# EAGLE design Cassette Port (EAGLE 9.5.2)
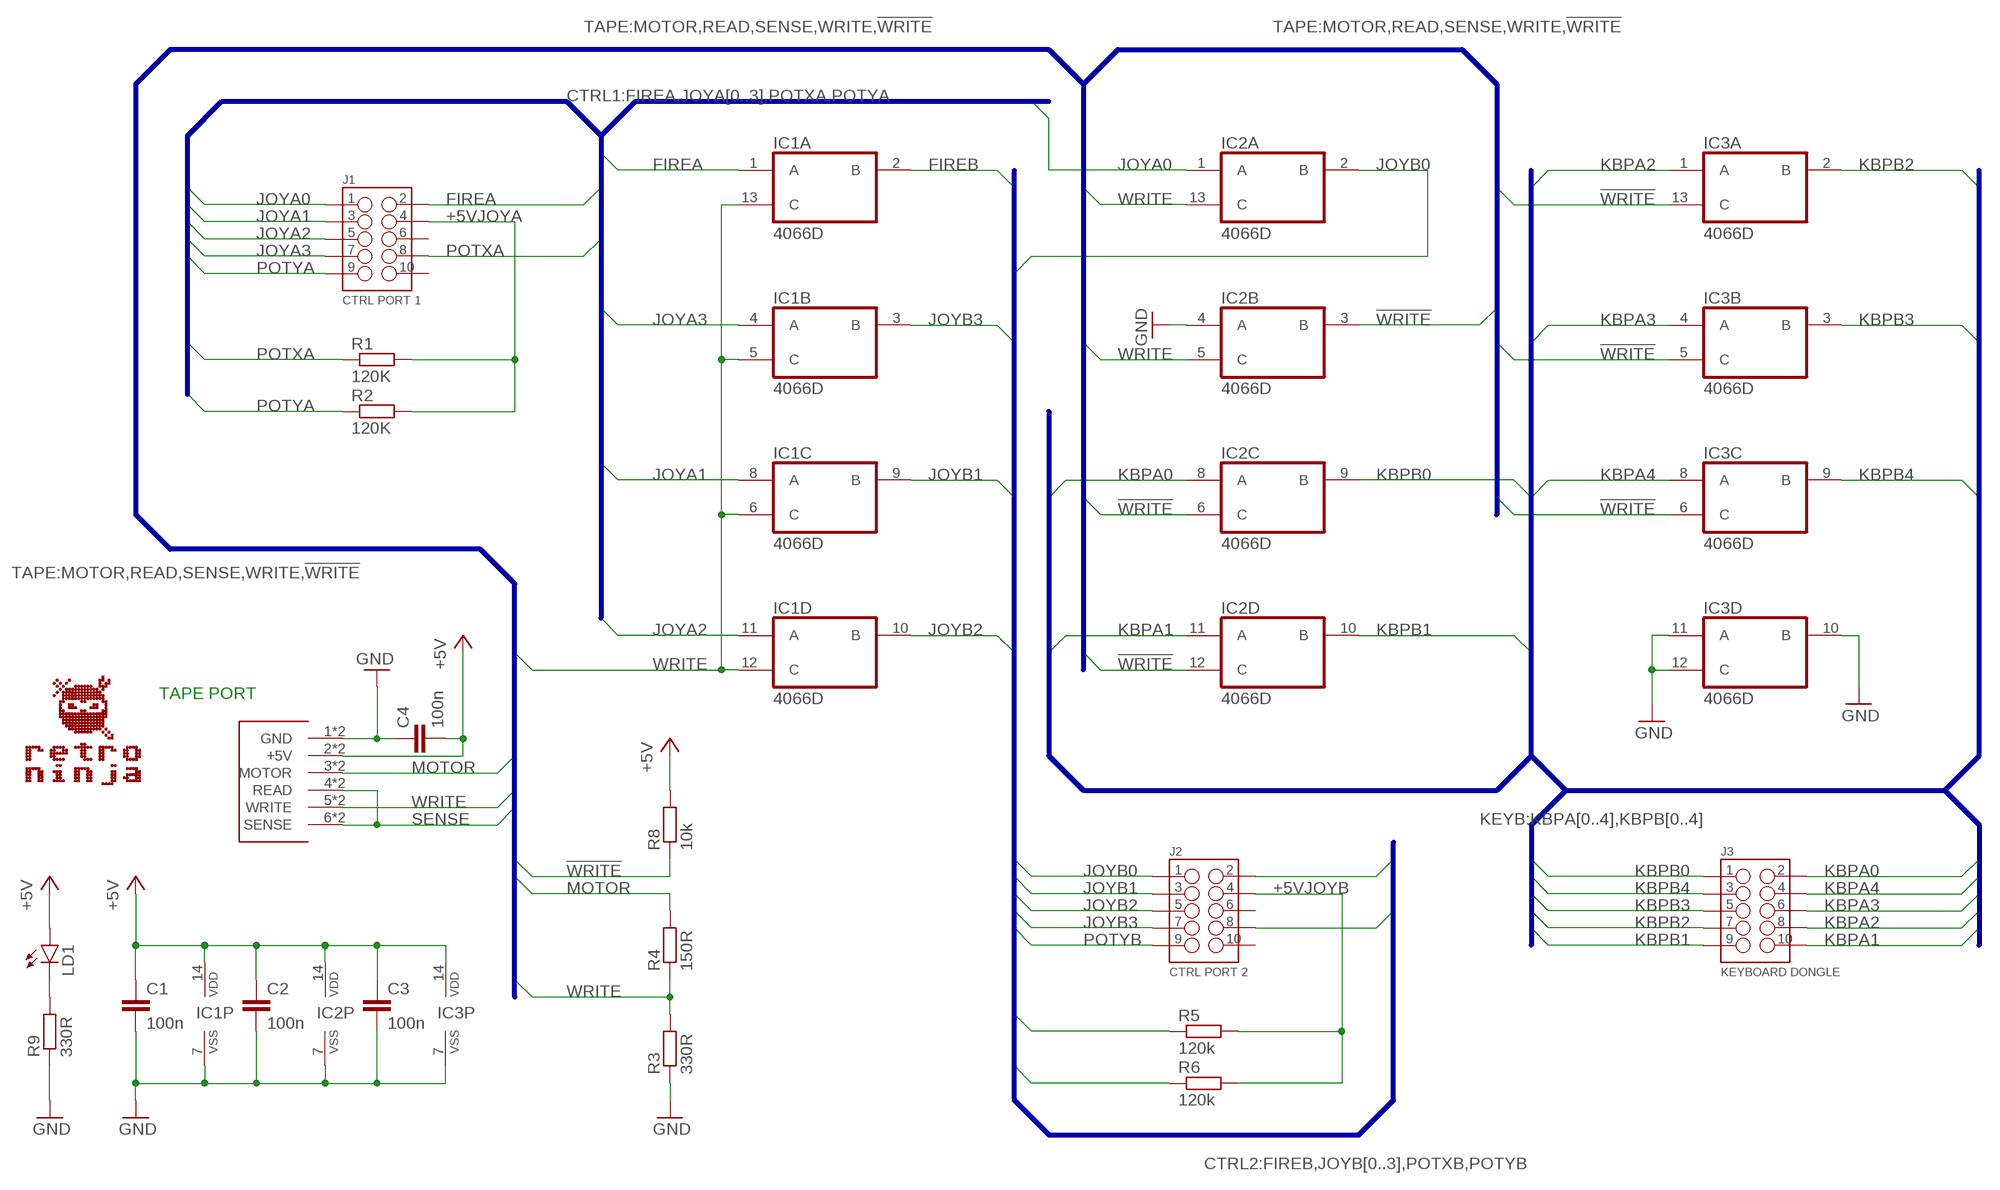
[diagram p0: schematic, sheet 1]

## Parts
C1  100n  C-EUC0805  [C0805]
C2  100n  C-EUC0805  [C0805]
C3  100n  C-EUC0805  [C0805]
C4  100n  C-EUC0805  [C0805]
CN1  C64_CASSETTE_PORT_CONNECTOR_SIDE  [C64_CASSETTE_CONNECTOR]
IC1  4066D  [SO14]
IC2  4066D  [SO14]
IC3  4066D  [SO14]
J1  CTRL PORT 1  HEADER_2X5-WALLED  [2X5_HEADER_WALLED]
J2  CTRL PORT 2  HEADER_2X5-WALLED  [2X5_HEADER_WALLED]
J3  KEYBOARD DONGLE  HEADER_2X5-WALLED  [2X5_HEADER_WALLED]
LD1  LED3MM  [LED3MM]
R1  120K  R-EU_R0805  [R0805]
R2  120K  R-EU_R0805  [R0805]
R3  330R  R-EU_R0805  [R0805]
R4  150R  R-EU_R0805  [R0805]
R5  120k  R-EU_R0805  [R0805]
R6  120k  R-EU_R0805  [R0805]
R8  10k  R-EU_R0805  [R0805]
R9  330R  R-EU_R0805  [R0805]
U$1  RETRONINJA_TEXT  [RETRONINJA_TEXT_17MM]

## Nets
!WRITE: IC2.3(B:B) IC2.6(C:C) IC2.12(D:C) IC3.5(B:C) IC3.6(C:C) IC3.13(A:C) R8.1
+5V: C1.1 C2.1 C3.1 C4.2 CN1.2(+5V) CN1.B(+5V) IC1.14(P:VDD) IC2.14(P:VDD) IC3.14(P:VDD) LD1.A R8.2
+5VJOYA: J1.4 R1.2 R2.2
+5VJOYB: J2.4 R5.2 R6.2
FIREA: IC1.1(A:A) J1.2
FIREB: IC1.2(A:B) J2.2
GND: C1.2 C2.2 C3.2 C4.1 CN1.1(GND) CN1.A(GND) IC1.7(P:VSS) IC2.4(B:A) IC2.7(P:VSS) IC3.7(P:VSS) IC3.10(D:B) IC3.11(D:A) IC3.12(D:C) R3.1 R9.1
JOYA0: IC2.1(A:A) J1.1
JOYA1: IC1.8(C:A) J1.3
JOYA2: IC1.11(D:A) J1.5
JOYA3: IC1.4(B:A) J1.7
JOYB0: IC2.2(A:B) J2.1
JOYB1: IC1.9(C:B) J2.3
JOYB2: IC1.10(D:B) J2.5
JOYB3: IC1.3(B:B) J2.7
KBPA0: IC2.8(C:A) J3.2
KBPA1: IC2.11(D:A) J3.10
KBPA2: IC3.1(A:A) J3.8
KBPA3: IC3.4(B:A) J3.6
KBPA4: IC3.8(C:A) J3.4
KBPB0: IC2.9(C:B) J3.1
KBPB1: IC2.10(D:B) J3.9
KBPB2: IC3.2(A:B) J3.7
KBPB3: IC3.3(B:B) J3.5
KBPB4: IC3.9(C:B) J3.3
MOTOR: CN1.3(MOTOR) CN1.C(MOTOR) R4.2
N$2: LD1.K(C) R9.2
POTXA: J1.8 R1.1
POTXB: J2.8 R5.1
POTYA: J1.9 R2.1
POTYB: J2.9 R6.1
SENSE: CN1.4(READ) CN1.6(SENSE) CN1.D(READ) CN1.F(SENSE)
WRITE: CN1.5(WRITE) CN1.E(WRITE) IC1.5(B:C) IC1.6(C:C) IC1.12(D:C) IC1.13(A:C) IC2.5(B:C) IC2.13(A:C) R3.2 R4.1
Unconnected: J1.6 J1.10 J2.6 J2.10

## Buses
CTRL1:FIREA,JOYA[0..3],POTXA,POTYA
CTRL2:FIREB,JOYB[0..3],POTXB,POTYB
TAPE:MOTOR,READ,SENSE,WRITE,!WRITE
KEYB:KBPA[0..4],KBPB[0..4]

## Notes on the sheet
- TAPE PORT

## Library data of the parts
C1-C4 = rcl:C-EU: CAPACITOR, European symbol; SPICEPREFIX: C
CN1 = Per:C64_CASSETTE_PORT
IC1-IC3 = 40xx:4066: Quad bilateral ANALOG SWITCH
J1-J3 = Per:HEADER_2X5
LD1 = led:LED: LED OSRAM: - CHIPLED LG R971, LG N971, LY N971, LG Q971, LY Q971, LO R971, LY R971 LH N974, LH R974 LS Q976, LO Q976, LY Q976 LO Q996 - Hyper CHIPLED LW Q18S LB Q993, LB Q99A, LB R99A - SideLED LS A670, LO A670, LY A670, LG A670, LP A670 LB A673, LV A673, LT A673, LW A673 LH A674 LY A675 LS A676, LA A676, LO A676, LY A676, LW A676 LS A679, LY A679, LG A679 - Hyper Micro SIDELED® LS Y876, LA Y876, LO Y876, LY Y876 LT Y87S - SmartLED LW L88C, LW L88S LB L89C, LB L89S, LG L890 LS L89K, LO L89K, LY L89K LS L896, LA L896, LO L896, LY L896 - TOPLED LS T670, LO T670, LY T670, LG T670, LP T670 LSG T670, LSP T670, LSY T670, LOP T670, LYG T670 LG T671, LOG T671, LSG T671 LB T673, LV T673, LT T673, LW T673 LH T674 LS T676, LA T676, LO T676, LY T676, LB T676, LH T676, LSB T676, LW T676 LB T67C, LV T67C, LT T67C, LS T67K, LO T67K, LY T67K, LW E67C LS E67B, LA E67B, LO E67B, LY E67B, LB E67C, LV E67C, LT E67C LW T67C LS T679, LY T679, LG T679 LS T770, LO T770, LY T770, LG T770, LP T770 LB T773, LV T773, LT T773, LW T773 LH T774 LS E675, LA E675, LY E675, LS T675 LS T776, LA T776, LO T776, LY T776, LB T776 LHGB T686 LT T68C, LB T68C - Hyper Mini TOPLED® LB M676 - Mini TOPLED Santana® LG M470 LS M47K, LO M47K, LY M47K Source: http://www.osram.convergy.de LUXEON: - LUMILED® LXK2-PW12-R00, LXK2-PW12-S00, LXK2-PW14-U00, LXK2-PW14-V00 LXK2-PM12-R00, LXK2-PM12-S00, LXK2-PM14-U00 LXK2-PE12-Q00, LXK2-PE12-R00, LXK2-PE12-S00, LXK2-PE14-T00, LXK2-PE14-U00 LXK2-PB12-K00, LXK2-PB12-L00, LXK2-PB12-M00, LXK2-PB14-N00, LXK2-PB14-P00, LXK2-PB14-Q00 LXK2-PR12-L00, LXK2-PR12-M00, LXK2-PR14-Q00, LXK2-PR14-R00 LXK2-PD12-Q00, LXK2-PD12-R00, LXK2-PD12-S00 LXK2-PH12-R00, LXK2-PH12-S00 LXK2-PL12-P00, LXK2-PL12-Q00, LXK2-PL12-R00 Source: www.luxeon.com KINGBRIGHT: KA-3528ASYC Source: www.kingbright.com
R1-R6 R8 R9 = rcl:R-EU_: RESISTOR, European symbol; SPICEPREFIX: R
U$1 = PCBGraphics:RETRONINJA_TEXT

## Board
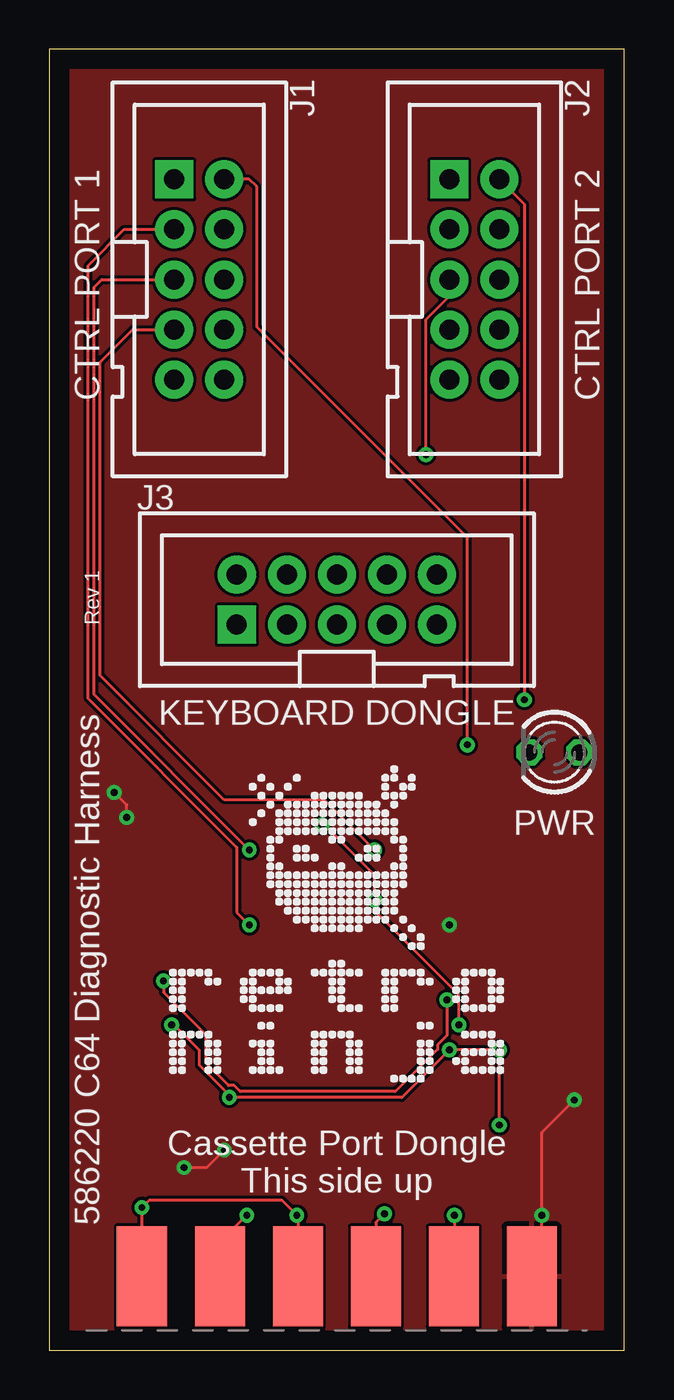
[diagram p1: board, top side]
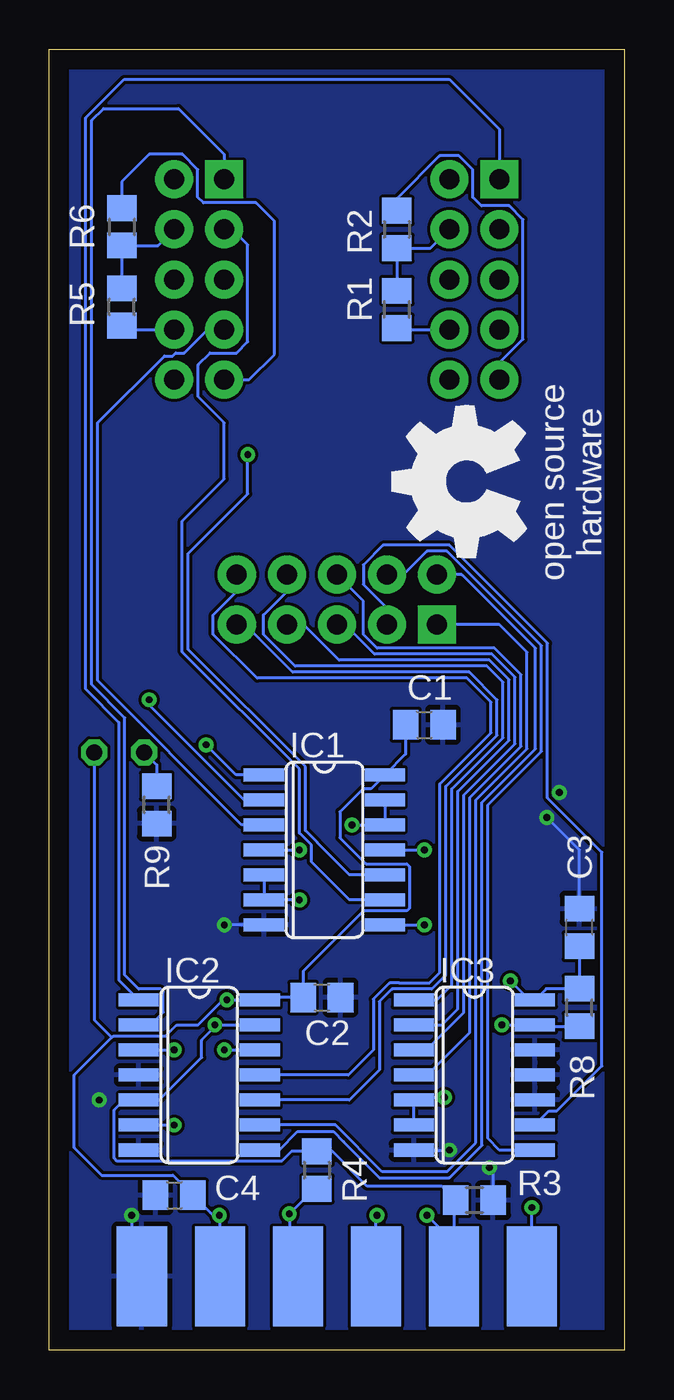
[diagram p2: board, bottom side, seen from below]

Size 29.21 x 66.04 mm. Coordinates in mm from the lower left corner, seen from the top.
Outline: 0,0 29.21,0 29.21,66.04 0,66.04 0,0
Copper layers (1*16): Top 0.035mm / dielectric 0.15mm / Bottom 0.035mm
Design rules "default": minimum track width 6mil, minimum drill 0.35mm, track to track 6mil, track to pad 6mil, pad to pad 6mil, via to via 6mil, smd to smd 6mil, copper to edge 40mil, drill to drill 6mil, minimum pad ring 10mil, minimum via ring 8mil, stop-mask expansion 4mil, vias tented up to drill 0mil, thermal gap 10mil

### Footprints (pad centres in the part's own frame; a part is rotated, then mirrored left to right if it is on the bottom)
C0805 = smd 1.3 x 1.5: 1 -0.95,0; 2 0.95,0
C64_CASSETTE_CONNECTOR = smd 2.54 x 5.08: 1 9.9,2.73; 2 5.94,2.73; 3 1.98,2.73; 4 -1.98,2.73; 5 -5.94,2.73; 6 -9.9,2.73 | smd 2.54 x 5.08 bottom: A 9.9,2.73; B 5.94,2.73; C 1.98,2.73; D -1.98,2.73; E -5.94,2.73; F -9.9,2.73
SO14 = smd 0.66 x 2.032: 1 -3.81,-3.073; 2 -2.54,-3.073; 3 -1.27,-3.073; 4 0,-3.073; 5 1.27,-3.073; 6 2.54,-3.073; 7 3.81,-3.073; 8 3.81,3.073; 9 2.54,3.073; 10 1.27,3.073; 11 0,3.073; 12 -1.27,3.073; 13 -2.54,3.073; 14 -3.81,3.073
2X5_HEADER_WALLED = drill 1.016 pad 1.93 square: 1 -5.08,-1.27 | drill 1.016 pad 1.93: 2 -5.08,1.27; 3 -2.54,-1.27; 4 -2.54,1.27; 5 0,-1.27; 6 0,1.27; 7 2.54,-1.27; 8 2.54,1.27; 9 5.08,-1.27; 10 5.08,1.27
LED3MM = drill 0.813 octagon: A -1.27,0; K 1.27,0
R0805 = smd 1.3 x 1.5: 1 -0.95,0; 2 0.95,0

### Placement (x,y rotation side)
C1  10.16,31.75 0 bottom
C2  15.37,17.91 0 bottom
C3  2.29,21.46 90 bottom
C4  22.86,7.87 0 bottom
CN1  14.61,1.02 0 top
IC1  15.24,25.4 270 bottom
IC2  21.59,13.97 270 bottom
IC3  7.62,13.97 270 bottom
J1  7.62,54.36 270 top
J2  21.59,54.36 270 top
J3  14.61,38.1 0 top
LD1  25.65,30.35 180 top
R1  11.56,52.83 90 bottom
R2  11.56,56.9 270 bottom
R3  7.62,7.62 180 bottom
R4  15.62,9.14 270 bottom
R5  25.53,52.96 90 bottom
R6  25.53,57.02 270 bottom
R8  2.29,17.4 90 bottom
R9  23.75,27.69 90 bottom
U$1  14.61,20.45 0 top
U$2  [OSHW_8MM]  8,44.07 90 bottom

### Tracks (layer width: path | path; a pad name or v marks a point on that pad's centre or on a via)
!WRITE  (via drill 0.35)
  Top 0.152: v6.22,16.51 6.35,16.51 7.62,15.24 7.62,14.48 9.14,12.95 v9.14,12.83 17.91,12.83 v20.32,15.24 v22.86,15.24 v22.86,11.43
  Bottom 0.152: IC3.6 IC3.5 10.57,12.83 v9.14,12.83 | IC2.3 v22.86,15.24 | v20.32,15.24 IC2.12 | v6.22,16.51 IC3.13 4.49,16.45 R8.1 | IC2.6 v22.86,11.43
+5V  (via drill 0.35)
  Top 0.152: v20.57,6.86 20.57,3.77 CN1.B | v20.19,17.78 20.19,15.97 19.71,15.49 19.71,15.27 17.58,13.13 9.7,13.13 9.39,13.43 9.1,13.43 7.97,14.56 7.97,16 5.8,18.17 v5.8,18.75
  Bottom 0.152: CN1.B 20.55,6.83 v20.57,6.86 20.89,6.86 C4.2 22.93,8.89 26.55,8.89 27.94,10.28 27.94,13.97 26.04,15.88 | v5.8,18.75 4.83,17.78 IC3.14 3.98,18.35 R8.2 C3.1 | C1.1 11.11,30.27 IC1.14 12.88,28.5 13.28,28.5 14.45,27.33 14.45,26.01 13.12,24.69 11.06,24.69 10.92,24.55 10.92,22.43 11.06,22.3 13.26,22.3 16.32,19.24 C2.1 18.39,17.91 IC2.14 v20.19,17.78 20.39,17.78 21.66,16.51 22.74,16.51 23.3,15.95 25.96,15.95 26.04,15.88 | LD1.A 26.92,16.76 26.04,15.88
+5VJOYA
  Bottom 0.152: J1.4 9.84,55.95 R2.2 R1.2
+5VJOYB
  Bottom 0.152: R5.2 R6.2 23.68,56.07 J2.4
FIREA  (via drill 0.35)
  Top 0.152: v21.24,30.73 21.24,41.25 10.54,51.94 10.54,59.05 10.16,59.44 J1.2
  Bottom 0.152: v21.24,30.73 19.71,29.21 IC1.1
FIREB  (via drill 0.35)
  Top 0.152: J2.2 24.13,58.17 v24.13,33.02
  Bottom 0.152: v24.13,33.02 24.13,32.77 19.3,27.94 IC1.2
GND  (via drill 0.35)
  Top 0.152: CN1.A 25.02,4.26 v25.02,6.86 25.02,11.05 v26.67,12.7 | v8.89,10.16 8,9.27 v6.86,9.27 | v3.94,27.05 3.94,27.68 v3.3,28.32
  Bottom 0.152: v25.02,6.86 25.02,4.26 CN1.A | IC3.7 v8.89,10.16 | v6.86,9.27 6.67,9.08 R3.1 | C3.2 2.29,25.4 v3.94,27.05 | IC1.7 v20.32,21.59
  pour Bottom: 0,0 0,66.04 29.21,66.04 29.21,0
  pour Top: 0,0 0,66.04 29.21,66.04 29.21,0
JOYA0
  Bottom 0.152: IC2.1 25.68,18.8 25.68,31.88 27.36,33.55 27.36,62.56 25.4,64.52 8.89,64.52 6.35,61.98 J1.1
JOYA1  (via drill 0.35)
  Top 0.152: J1.3 3.81,56.9 1.98,55.07 1.98,33.07 9.53,25.53 9.53,22.23 v10.16,21.59
  Bottom 0.152: IC1.8 v10.16,21.59
JOYA2  (via drill 0.35)
  Top 0.152: v10.16,25.4 2.29,33.27 2.29,53.98 2.67,54.36 J1.5
  Bottom 0.152: IC1.11 v10.16,25.4
JOYA3  (via drill 0.35)
  Top 0.152: v16.51,25.4 13.97,27.94 8.89,27.94 2.59,34.24 2.59,50.16 4.24,51.82 J1.7
  Bottom 0.152: IC1.4 v16.51,25.4
JOYB0
  Bottom 0.152: J2.1 20.32,60.71 22.64,63.03 26.45,63.03 27.05,62.43 27.05,33.78 25.38,32.11 25.38,19.05 24.66,18.34 23.55,18.34 23.42,18.2 23.42,17.15 24.06,16.51 IC2.2
JOYB1
  Bottom 0.152: IC1.9 13.97,22.86 15.9,24.79 15.9,25.65 16.51,26.26 16.51,29.5 22.45,35.45 22.45,42.1 20.32,44.23 20.32,47.08 21.64,48.4 21.64,50.02 21.04,50.62 19.7,50.62 19.13,51.2 19.13,56.12 19.9,56.9 J2.3
JOYB2  (via drill 0.35)
  Top 0.152: J2.5 20.32,53.5 19.13,52.31 v19.13,45.47
  Bottom 0.152: IC1.10 13.97,24.13 15.6,25.76 15.6,25.78 16.2,26.38 16.2,29.63 22.15,35.57 22.15,40.45 19.13,43.47 v19.13,45.47
JOYB3
  Bottom 0.152: IC1.3 19.43,26.67 26.75,33.98 26.75,47.08 23.35,50.47 22.94,50.47 22.78,50.62 22.37,50.62 21.17,51.82 J2.7
KBPA0
  Bottom 0.152: IC2.8 17.53,10.16 16.59,11.1 14.78,11.1 14.26,10.59 14.26,10.58 12.45,8.76 8.89,8.76 7.24,10.41 7.24,27.81 4.52,30.52 4.52,35.64 8.26,39.37 J3.2
KBPA1
  Bottom 0.152: J3.10 19.68,38.52 20.88,37.32 20.88,36.34 18.66,34.11 8,34.11 6.78,32.89 6.78,31.34 9.37,28.75 9.37,19.18 9.9,18.64 11.43,18.64 11.93,18.64 12.75,17.82 12.75,15.24 14.02,13.97 IC2.11
KBPA2
  Bottom 0.152: IC3.1 9.53,17.78 8.76,18.54 8.76,28.5 6.17,31.09 6.17,33.91 6.98,34.72 16.73,34.72 18.34,36.34 18.34,36.83 18.34,37.13 18.34,37.32 17.14,38.52 J3.8
KBPA3
  Bottom 0.152: IC3.4 10.01,13.97 7.85,16.13 7.85,28.06 5.26,30.65 5.26,34.29 6.6,35.64 12.56,35.64 13.26,36.34 13.26,38.02 J3.6
KBPA4
  Bottom 0.152: IC3.8 6.35,10.16 6.93,10.74 6.93,27.68 4.22,30.4 4.22,35.76 9.02,40.56 10.02,40.56 11.21,39.37 J3.4
KBPB0
  Bottom 0.152: J3.1 6.35,36.83 4.95,35.43 4.95,30.52 7.54,27.93 7.54,10.54 9.02,9.07 12.31,9.07 14.68,11.43 IC2.9
KBPB1
  Bottom 0.152: IC2.10 13.97,12.7 12.45,14.22 12.45,17.7 11.8,18.34 9.78,18.34 9.07,19.05 9.07,28.62 6.48,31.21 6.48,33.02 7.87,34.42 16.85,34.42 19.26,36.83 J3.9
KBPB2
  Bottom 0.152: IC3.2 9.27,16.51 8.46,17.32 8.46,28.37 5.87,30.96 5.87,34.04 6.86,35.03 14.49,35.03 16.29,36.83 J3.7
KBPB3
  Bottom 0.152: IC3.3 10.06,15.24 8.15,17.14 8.15,28.18 5.56,30.78 5.56,34.16 6.73,35.33 12.69,35.33 14.18,36.83 J3.5
KBPB4
  Bottom 0.152: J3.3 12.06,37.68 13.26,38.88 13.26,39.86 12.26,40.87 8.89,40.87 3.91,35.89 3.91,28.04 1.14,25.27 1.14,14.43 3.44,12.14 3.83,12.14 IC3.9
MOTOR  (via drill 0.35)
  Top 0.152: v17.02,6.92 16.59,6.49 CN1.C
  Bottom 0.152: R4.2 15.75,8.19 v17.02,6.92 17.02,4.18 CN1.C
N$2
  Bottom 0.152: LD1.K 23.75,29.72 R9.2
POTXA
  Bottom 0.152: R1.1 11.49,51.82 J1.8
POTXB
  Bottom 0.152: R5.1 25.33,51.82 J2.8
POTYA
  Bottom 0.152: J1.9 6.35,50.13 5.16,51.32 5.16,57.39 5.86,58.09 7.26,58.09 7.7,58.53 7.7,59.93 8.4,60.63 9.38,60.63 11.56,58.46 R2.1
POTYB
  Bottom 0.152: J2.9 19.05,49.28 17.78,50.55 17.78,57.31 18.71,58.24 21.38,58.24 21.67,58.53 21.67,59.93 22.44,60.71 24.13,60.71 25.53,59.31 R6.1
SENSE  (via drill 0.35)
  Top 0.152: CN1.D 12.62,6.81 v12.57,6.86 11.81,7.62 5.08,7.62 v4.71,7.25 CN1.F
  Bottom 0.152: CN1.D 12.62,6.81 v12.57,6.86 | CN1.F v4.71,7.25
WRITE  (via drill 0.35)
  Top 0.152: v10.03,6.86 8.66,5.49 CN1.E | v20.8,16.51 20.8,18.03 16.51,22.32 v16.51,22.86 16.51,24.13 13.97,26.67 v13.84,26.67
  Bottom 0.152: CN1.E 8.66,5.49 | 8.66,5.49 v10.03,6.86 | 8.66,5.49 8.66,7.53 R3.2 9.28,8.33 13.07,8.33 14.84,10.09 R4.1 16.91,10.09 17.41,9.6 25.77,9.6 25.91,9.73 25.91,12.19 25.4,12.7 IC2.5 23.62,12.7 21.46,14.86 21.46,15.75 20.7,16.51 | 20.7,16.51 IC2.13 | IC1.5 IC1.6 v16.51,22.86 | IC1.13 IC1.12 v13.84,26.67 | 20.7,16.51 v20.8,16.51

### Text on the board
tPlace: Rev 1 | PWR | Cassette Port Dongle / This side up | 586220 C64 Diagnostic Harness